# EAGLE design naked (EAGLE 7.4.0)
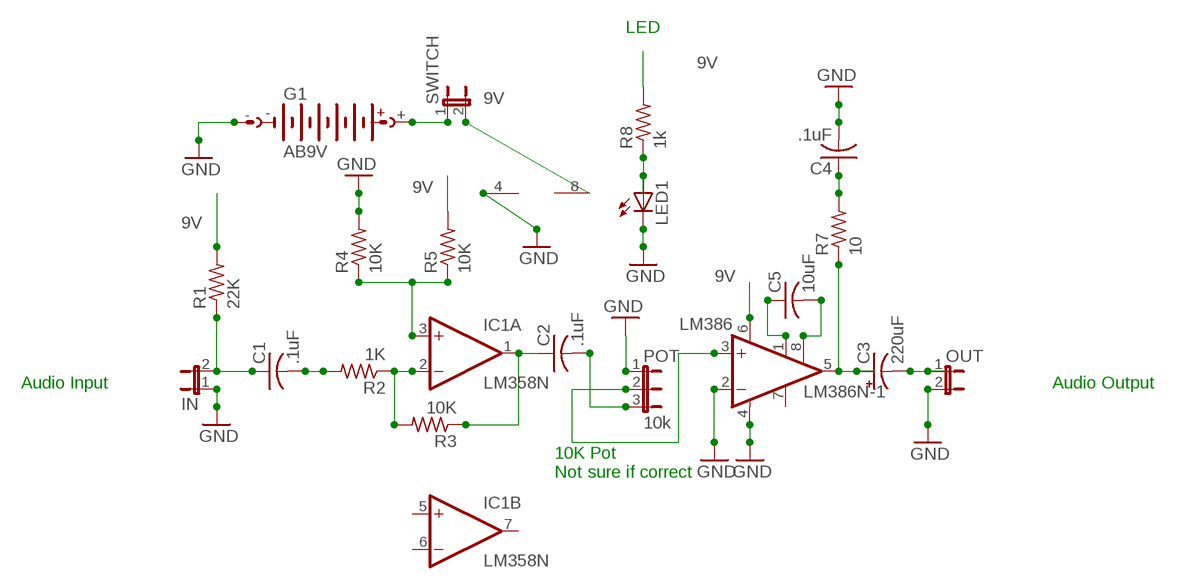
[diagram p0: schematic, sheet 1]

## Parts
C1  .1uF  C-US025-024X044  [C025-024X044]
C2  .1uF  C-US025-024X044  [C025-024X044]
C3  220uF  CPOL-USE3.5-8  [E3,5-8]
C4  .1uF  C-US025-024X044  [C025-024X044]
C5  10uF  C-US025-024X044  [C025-024X044]
G1  AB9V  [AB9V]
IC1  LM358N  [DIL08]
IN  JP1E  [JP1]
LED1  LED5MM  [LED5MM]
LM386  LM386N-1  [DIL08]
OUT  JP1E  [JP1]
POT  10k  JP2E  [JP2]
R1  22K  R-US_0204/7  [0204/7]
R2  1K  R-US_0204/7  [0204/7]
R3  10K  R-US_0204/7  [0204/7]
R4  10K  R-US_0204/7  [0204/7]
R5  10K  R-US_0204/7  [0204/7]
R7  10  R-US_0204/7  [0204/7]
R8  1k  R-US_0204/7  [0204/7]
SWITCH  JP1E  [JP1]

## Nets
9V: IC1.8(P:V+) LM386.6(VS) R1.2 R5.2 R8.2 SWITCH.2
GND: C4.2 G1.- IC1.4(P:V-) IN.1 LED1.K(C) LM386.2(-IN) LM386.4(GND) OUT.2 POT.1 R4.2
N$1: G1.+ SWITCH.1
N$2: C1.1 IN.2 R1.1
N$3: C1.2 R2.2
N$4: IC1.2(A:-IN) R2.1 R3.2
N$5: C5.1 LM386.1(GAIN)
N$6: IC1.3(A:+IN) R4.1 R5.1
N$7: C2.1 IC1.1(A:OUT) R3.1
N$8: C2.2 POT.3
N$9: LM386.3(+IN) POT.2
N$10: C3.+ LM386.5(OUT) R7.1
N$11: C3.- OUT.1
N$12: LED1.A R8.1
N$13: C4.1 R7.2
N$14: C5.2 LM386.8(GAIN)
Unconnected: IC1.5(B:+IN) IC1.6(B:-IN) IC1.7(B:OUT) LM386.7(BYPASS)

## Notes on the sheet
- LED
- Audio Input | Audio Output
- 10K Pot
  Not sure if correct

## Library data of the parts
C1 C2 C4 C5 = resistor:C-US: CAPACITOR, American symbol
C3 = rcl:CPOL-US: POLARIZED CAPACITOR, American symbol
G1 = battery:AB9V: 9-V BATTERY CLIP
IC1 = linear:LM358: OP AMP also LM158; LM258; LM2904 Source: http://cache.national.com/ds/LM/LM158.pdf
IN OUT SWITCH = jumper:JP1E: JUMPER
LED1 = led:LED: LED OSRAM: - CHIPLED LG R971, LG N971, LY N971, LG Q971, LY Q971, LO R971, LY R971 LH N974, LH R974 LS Q976, LO Q976, LY Q976 LO Q996 - Hyper CHIPLED LW Q18S LB Q993, LB Q99A, LB R99A - SideLED LS A670, LO A670, LY A670, LG A670, LP A670 LB A673, LV A673, LT A673, LW A673 LH A674 LY A675 LS A676, LA A676, LO A676, LY A676, LW A676 LS A679, LY A679, LG A679 - Hyper Micro SIDELED® LS Y876, LA Y876, LO Y876, LY Y876 LT Y87S - SmartLED LW L88C, LW L88S LB L89C, LB L89S, LG L890 LS L89K, LO L89K, LY L89K LS L896, LA L896, LO L896, LY L896 - TOPLED LS T670, LO T670, LY T670, LG T670, LP T670 LSG T670, LSP T670, LSY T670, LOP T670, LYG T670 LG T671, LOG T671, LSG T671 LB T673, LV T673, LT T673, LW T673 LH T674 LS T676, LA T676, LO T676, LY T676, LB T676, LH T676, LSB T676, LW T676 LB T67C, LV T67C, LT T67C, LS T67K, LO T67K, LY T67K, LW E67C LS E67B, LA E67B, LO E67B, LY E67B, LB E67C, LV E67C, LT E67C LW T67C LS T679, LY T679, LG T679 LS T770, LO T770, LY T770, LG T770, LP T770 LB T773, LV T773, LT T773, LW T773 LH T774 LS E675, LA E675, LY E675, LS T675 LS T776, LA T776, LO T776, LY T776, LB T776 LHGB T686 LT T68C, LB T68C - Hyper Mini TOPLED® LB M676 - Mini TOPLED Santana® LG M470 LS M47K, LO M47K, LY M47K Source: http://www.osram.convergy.de LUXEON: - LUMILED® LXK2-PW12-R00, LXK2-PW12-S00, LXK2-PW14-U00, LXK2-PW14-V00 LXK2-PM12-R00, LXK2-PM12-S00, LXK2-PM14-U00 LXK2-PE12-Q00, LXK2-PE12-R00, LXK2-PE12-S00, LXK2-PE14-T00, LXK2-PE14-U00 LXK2-PB12-K00, LXK2-PB12-L00, LXK2-PB12-M00, LXK2-PB14-N00, LXK2-PB14-P00, LXK2-PB14-Q00 LXK2-PR12-L00, LXK2-PR12-M00, LXK2-PR14-Q00, LXK2-PR14-R00 LXK2-PD12-Q00, LXK2-PD12-R00, LXK2-PD12-S00 LXK2-PH12-R00, LXK2-PH12-S00 LXK2-PL12-P00, LXK2-PL12-Q00, LXK2-PL12-R00 Source: www.luxeon.com KINGBRIGHT: KA-3528ASYC Source: www.kingbright.com
LM386 = linear:LM386?-*: Low Voltage Audio Power Amplifier Source: http://cache.national.com/ds/LM/LM386.pdf
POT = jumper:JP2E: JUMPER
R1-R5 R7 R8 = resistor:R-US_: RESISTOR, American symbol

## Board
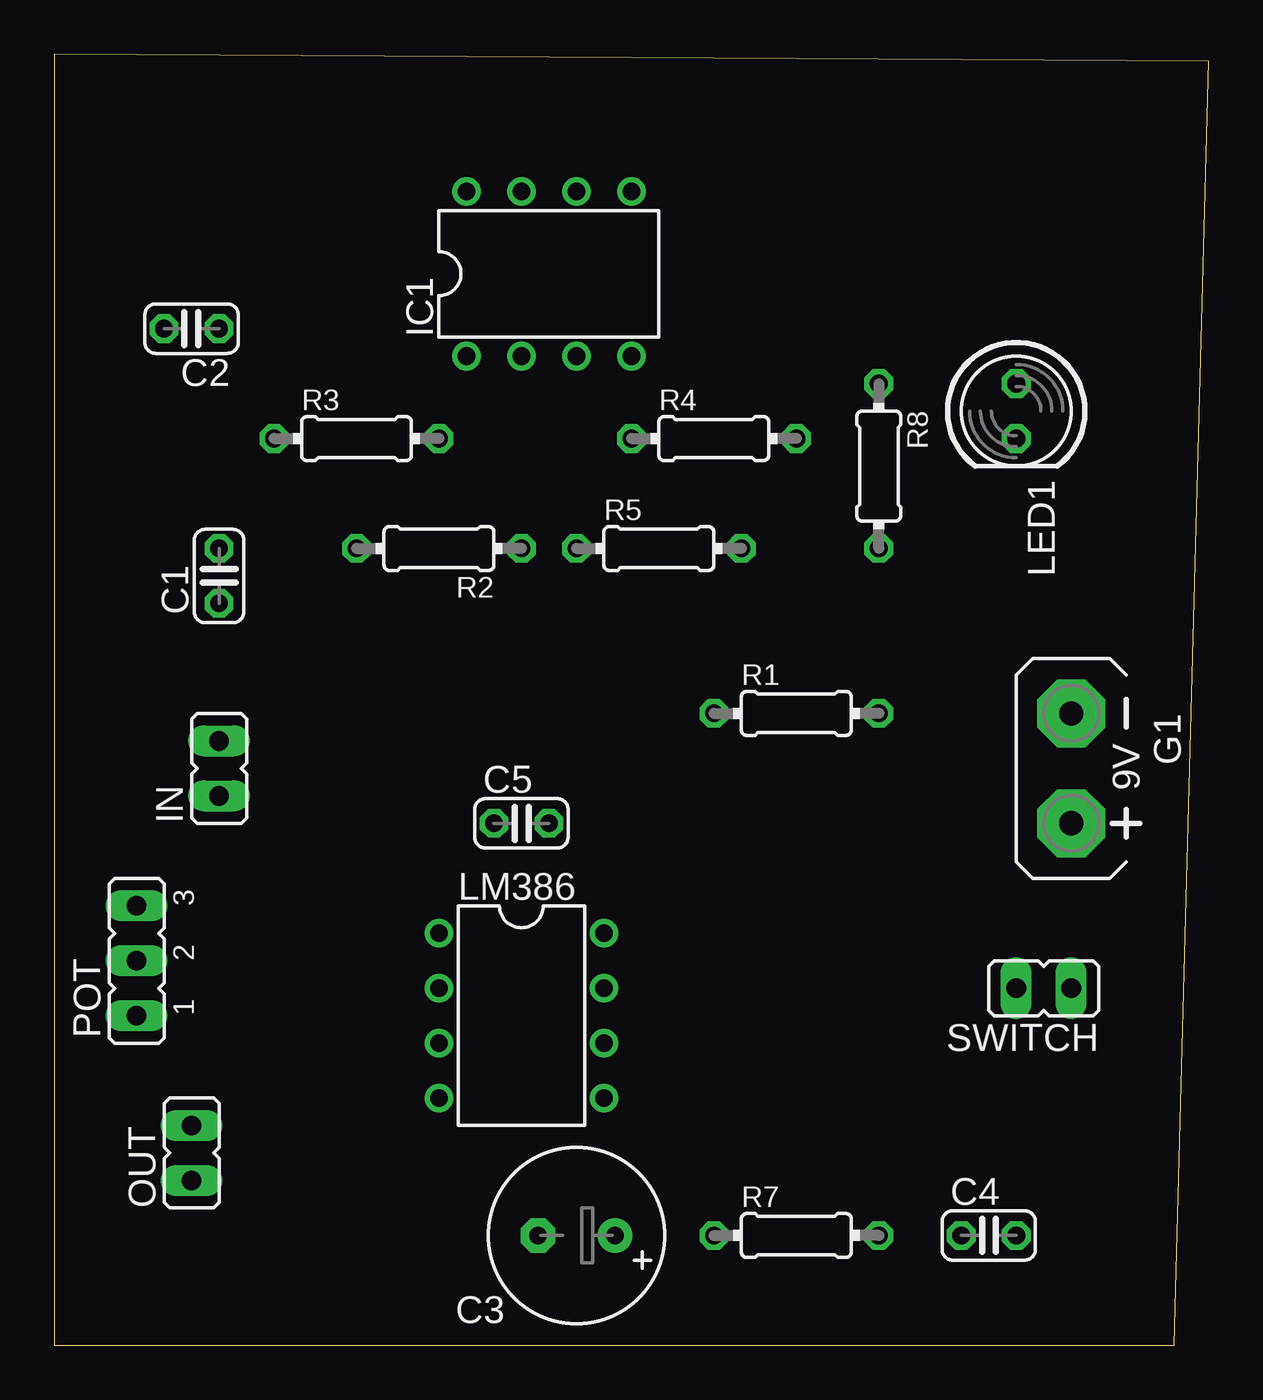
[diagram p1: board, top side]
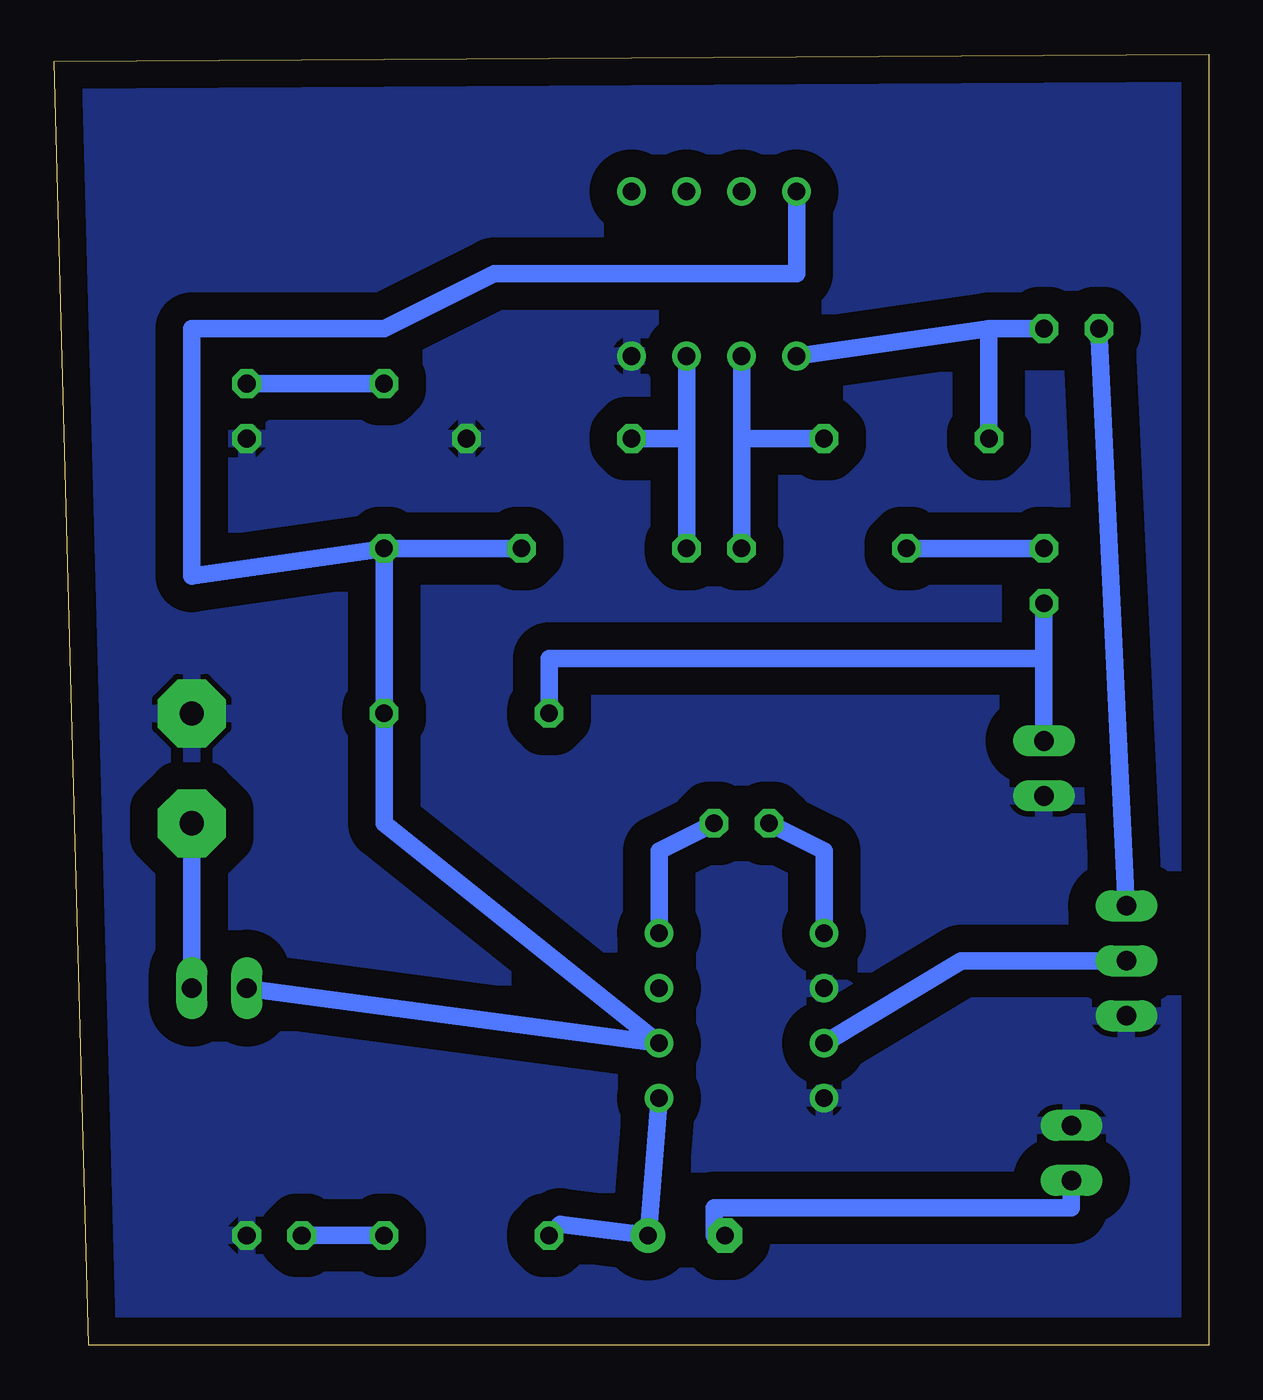
[diagram p2: board, bottom side, seen from below]

Size 53.35 x 59.68 mm. Coordinates in mm from the lower left corner, seen from the top.
Outline: 0,0 51.74,0 53.35,59.36 0,59.68 0,0
Copper layers (1*16): Top 0.035mm / dielectric 1.5mm / Bottom 0.035mm
Design rules "default": minimum track width 10mil, minimum drill 24mil, track to track 8mil, track to pad 8mil, pad to pad 8mil, via to via 8mil, smd to smd 8mil, copper to edge 40mil, drill to drill 8mil, minimum pad ring 10mil, minimum via ring 8mil, stop-mask expansion 4mil, vias tented up to drill 0mil, thermal gap 10mil

### Footprints (pad centres in the part's own frame; a part is rotated, then mirrored left to right if it is on the bottom)
C025-024X044 = drill 0.813 octagon: 1 -1.27,0; 2 1.27,0
E3,5-8 = drill 0.813 pad 1.6: + -1.778,0 | drill 0.813 pad 1.6 octagon: - 1.778,0
AB9V = drill 1.118 pad 3.15 octagon: + 0,2.54; - 0,-2.54
DIL08 = drill 0.813 pad 1.27: 1 -3.81,-3.81; 2 -1.27,-3.81; 3 1.27,-3.81; 4 3.81,-3.81; 5 3.81,3.81; 6 1.27,3.81; 7 -1.27,3.81; 8 -3.81,3.81
JP1 = drill 0.914 long: 1 0,-1.27; 2 0,1.27
LED5MM = drill 0.813 octagon: A -1.27,0; K 1.27,0
JP2 = drill 0.914 long: 1 -2.54,0; 2 0,0; 3 2.54,0
0204/7 = drill 0.813 octagon: 1 -3.81,0; 2 3.81,0

### Placement (x,y rotation side)
C1  7.62,35.56 90 top
C2  6.35,46.99 180 top
C3  24.13,5.08 180 top
C4  43.18,5.08 0 top
C5  21.59,24.13 0 top
G1  46.99,26.67 180 top
IC1  22.86,49.53 0 top
IN  7.62,26.67 0 top
LED1  44.45,43.18 270 top
LM386  21.59,15.24 270 top
OUT  6.35,8.89 0 top
POT  3.81,17.78 90 top
R1  34.29,29.21 0 top
R2  17.78,36.83 180 top
R3  13.97,41.91 0 top
R4  30.48,41.91 0 top
R5  27.94,36.83 0 top
R7  34.29,5.08 0 top
R8  38.1,40.64 270 top
SWITCH  45.72,16.51 90 top

### Tracks (layer width: path | path; a pad name or v marks a point on that pad's centre or on a via)
9V
  Bottom 0.813: SWITCH.2 LM386.6 38.1,24.13 R1.2 R8.2 | R5.2 R8.2 | IC1.8 19.05,49.53 33.02,49.53 38.1,46.99 46.99,46.99 46.99,35.56 R8.2
GND
  pour Bottom (isolate 1.27): 0,0 0,59.69 53.34,59.69 52.07,0
N$1
  Bottom 0.813: SWITCH.1 G1.+
N$2
  Bottom 0.813: IN.2 7.62,31.75 | 7.62,31.75 C1.1 | R1.1 30.48,31.75 7.62,31.75
N$3
  Bottom 0.813: C1.2 R2.2
N$4
  Bottom 0.813: R2.1 21.59,41.91 | 21.59,41.91 IC1.2 | R3.2 21.59,41.91
N$5
  Bottom 0.813: LM386.1 17.78,22.86 C5.1
N$6
  Bottom 0.813: IC1.3 24.13,41.91 | 24.13,41.91 R5.1 | R4.1 24.13,41.91
N$7
  Bottom 0.813: C2.1 10.16,46.99 | 10.16,46.99 IC1.1 | R3.1 10.16,46.99
N$8
  Bottom 0.813: C2.2 POT.3
N$9
  Bottom 0.813: POT.2 11.43,17.78 LM386.3
N$10
  Bottom 0.813: R7.1 29.97,5.59 C3.+ LM386.5
N$11
  Bottom 0.813: OUT.1 6.35,6.35 22.86,6.35 22.86,5.08 C3.-
N$12
  Bottom 0.813: R8.1 LED1.A
N$13
  Bottom 0.813: R7.2 C4.1
N$14
  Bottom 0.813: LM386.8 25.4,22.86 C5.2